# EAGLE schematic Powerboard (EAGLE 9.6.2)

## Sheet 1 of 2: POWER
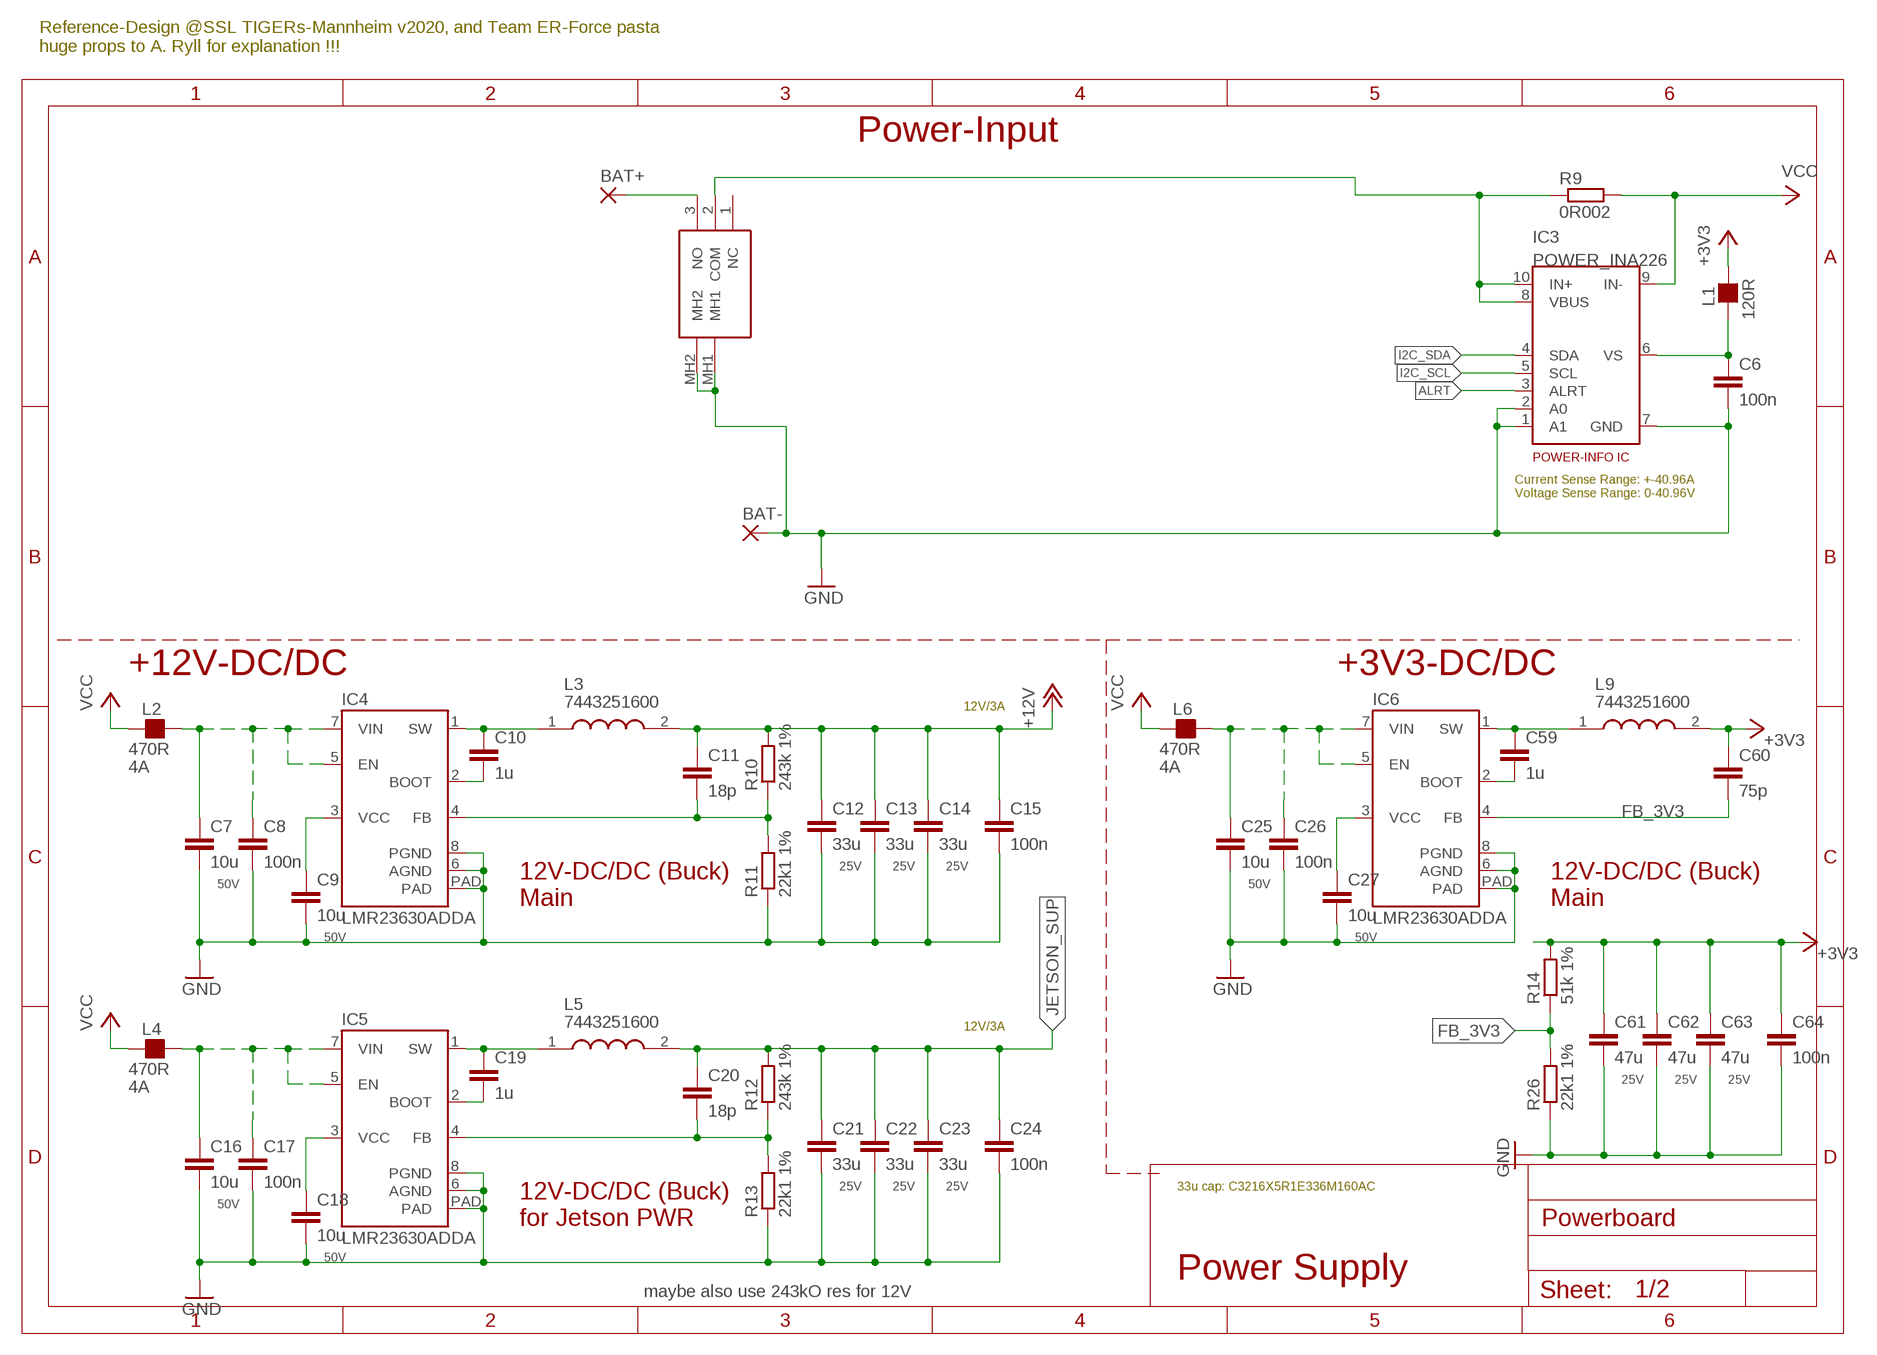
[diagram p0: schematic, sheet 1, part 1 of 2]
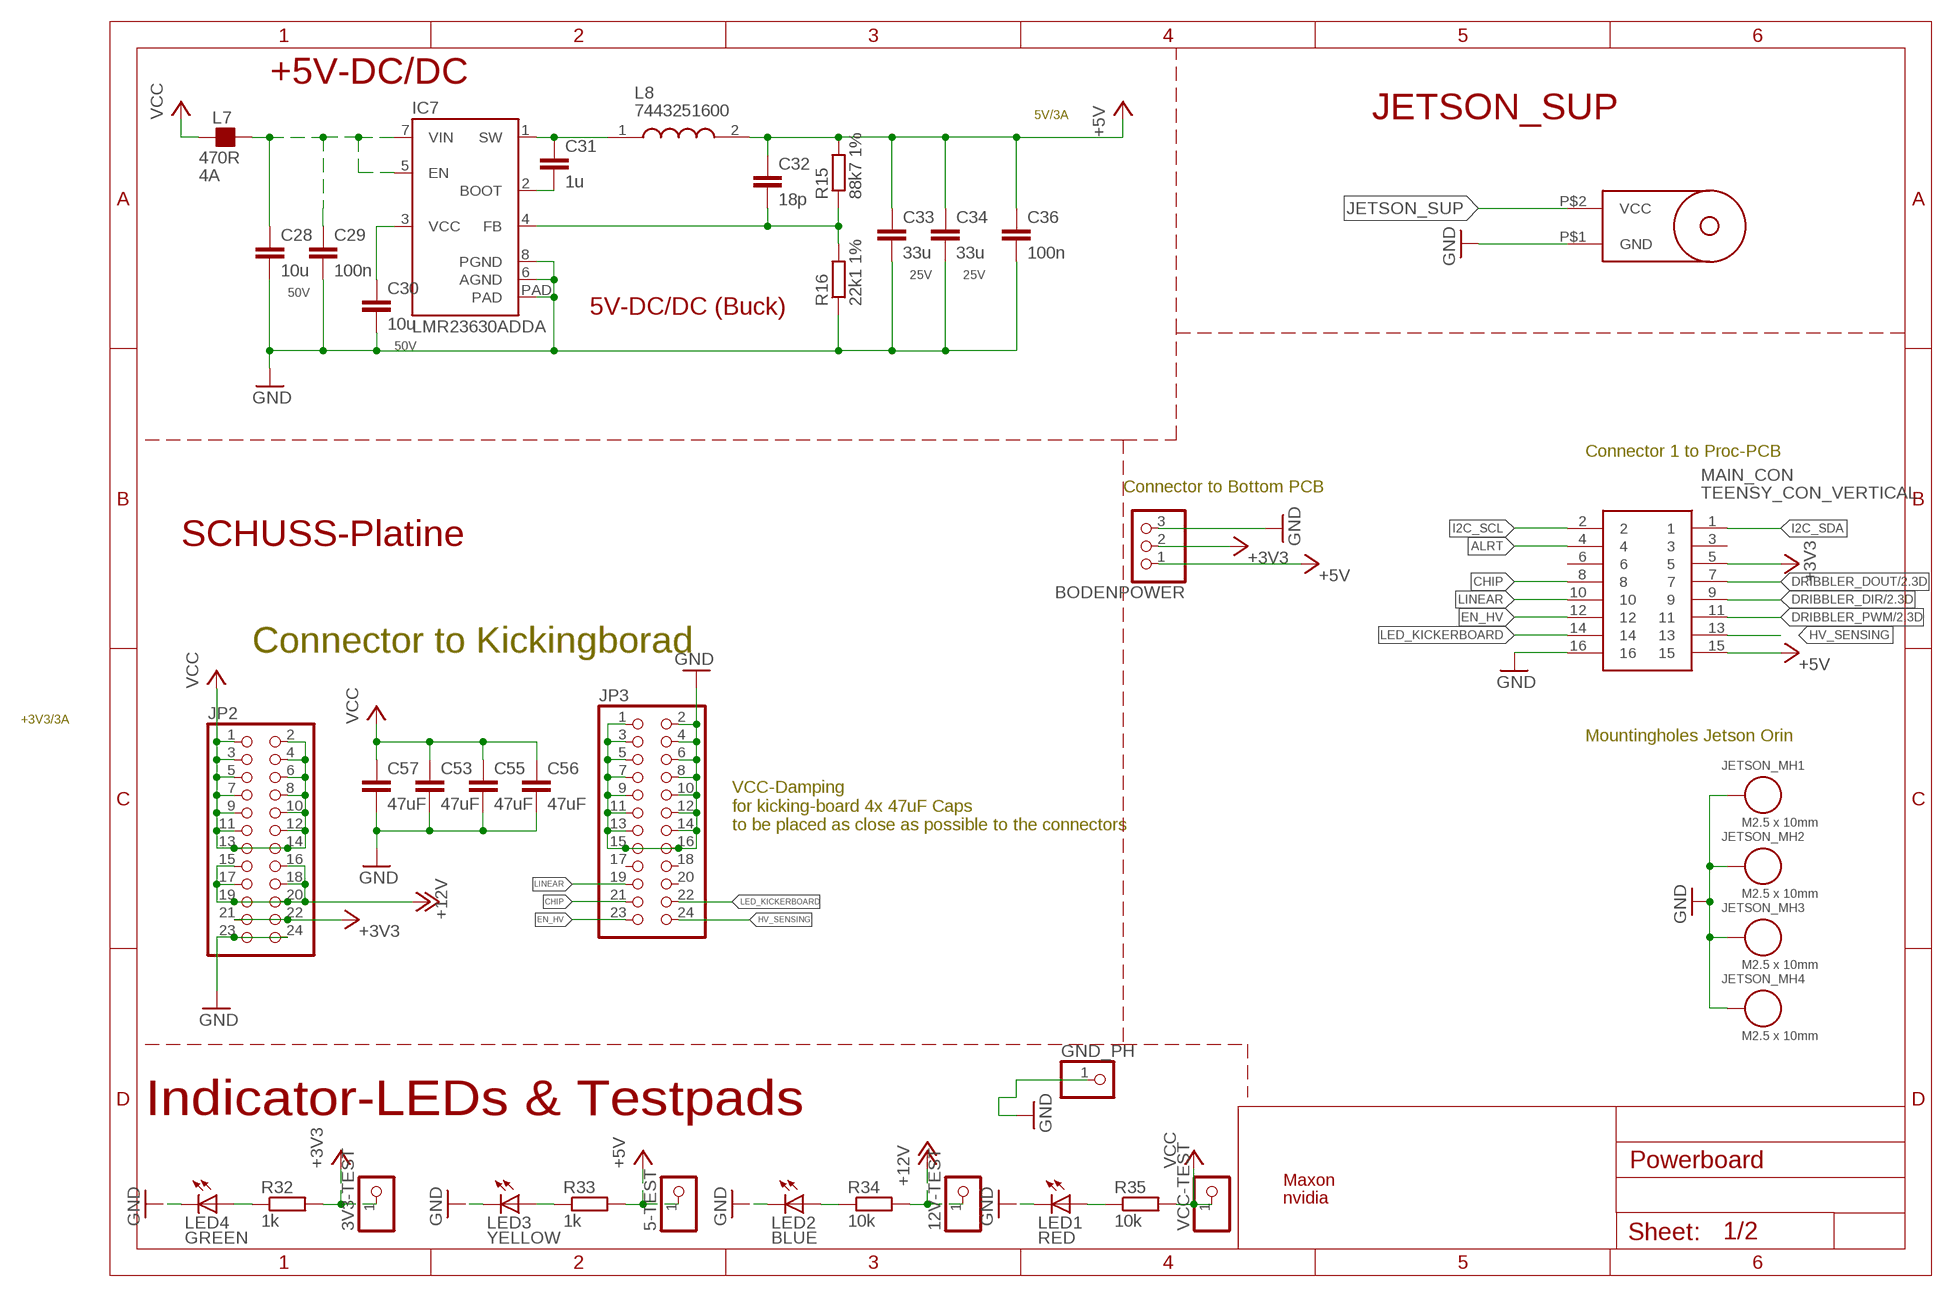
[diagram p1: schematic, sheet 1, part 2 of 2]

### Parts
3V3-TEST  PINHD-1X1  [1X01]
5-TEST  PINHD-1X1  [1X01]
12V-TEST  PINHD-1X1  [1X01]
BAT+  WIREPAD5,08/3  [5,08/3]
BAT-  WIREPAD5,08/3  [5,08/3]
BODENPOWER  PINHD-1X3  [1X03]
C6  100n  C-EUC0603  [C0603]
C7  10u  C-EUC1206  [C1206]
C8  100n  C-EUC0603  [C0603]
C9  10u  C-EUC1206  [C1206]
C10  1u  C-EUC0603  [C0603]
C11  18p  C-EUC0603  [C0603]
C12  33u  C-EUC1206  [C1206]
C13  33u  C-EUC1206  [C1206]
C14  33u  C-EUC1206  [C1206]
C15  100n  C-EUC0603  [C0603]
C16  10u  C-EUC1206  [C1206]
C17  100n  C-EUC0603  [C0603]
C18  10u  C-EUC1206  [C1206]
C19  1u  C-EUC0603  [C0603]
C20  18p  C-EUC0603  [C0603]
C21  33u  C-EUC1206  [C1206]
C22  33u  C-EUC1206  [C1206]
C23  33u  C-EUC1206  [C1206]
C24  100n  C-EUC0603  [C0603]
C25  10u  C-EUC1206  [C1206]
C26  100n  C-EUC0603  [C0603]
C27  10u  C-EUC1206  [C1206]
C28  10u  C-EUC1206  [C1206]
C29  100n  C-EUC0603  [C0603]
C30  10u  C-EUC1206  [C1206]
C31  1u  C-EUC0603  [C0603]
C32  18p  C-EUC0603  [C0603]
C33  33u  C-EUC1206  [C1206]
C34  33u  C-EUC1206  [C1206]
C36  100n  C-EUC0603  [C0603]
C53  47uF  C-EUC1210  [C1210]
C55  47uF  C-EUC1210  [C1210]
C56  47uF  C-EUC1210  [C1210]
C57  47uF  C-EUC1210  [C1210]
C59  1u  C-EUC0603  [C0603]
C60  75p  C-EUC0603  [C0603]
C61  47u  C-EUC1206  [C1206]
C62  47u  C-EUC1206  [C1206]
C63  47u  C-EUC1206  [C1206]
C64  100n  C-EUC0603  [C0603]
GND_PH  PINHD-1X1  [1X01]
IC3  POWER_INA226  [TIGERS_DGS_S-PDSO-G10]
IC4  LMR23630ADDA  POWER_LMR23630_DDA  [TIGERS_DDA_R-PDSO-G8]
IC5  LMR23630ADDA  POWER_LMR23630_DDA  [TIGERS_DDA_R-PDSO-G8]
IC6  LMR23630ADDA  POWER_LMR23630_DDA  [TIGERS_DDA_R-PDSO-G8]
IC7  LMR23630ADDA  POWER_LMR23630_DDA  [TIGERS_DDA_R-PDSO-G8]
JETSON_MH1  M2.5 x 10mm  M2.5_STEELSPACER_9774100151R  [WA-SMSI_9774100151]
JETSON_MH2  M2.5 x 10mm  M2.5_STEELSPACER_9774100151R  [WA-SMSI_9774100151]
JETSON_MH3  M2.5 x 10mm  M2.5_STEELSPACER_9774100151R  [WA-SMSI_9774100151]
JETSON_MH4  M2.5 x 10mm  M2.5_STEELSPACER_9774100151R  [WA-SMSI_9774100151]
JP2  PINHD-2X12  [2X12]
JP3  PINHD-2X12  [2X12]
L1  120R  FB_0603  [L0603]
L2  470R  FB_1206  [L1206]
L3  7443251600  POWER_WE_HCI  [7443251600_WE-HCI_105023]
L4  470R  FB_1206  [L1206]
L5  7443251600  POWER_WE_HCI  [7443251600_WE-HCI_105023]
L6  470R  FB_1206  [L1206]
L7  470R  FB_1206  [L1206]
L8  7443251600  POWER_WE_HCI  [7443251600_WE-HCI_105023]
L9  7443251600  POWER_WE_HCI  [7443251600_WE-HCI_105023]
LED1  RED  POWER_LED-RED-CHIPLED_0805  [POWER_DISTRIBUTION_CHIPLED_0805]
LED2  BLUE  POWER_LED-RED-CHIPLED_0805  [POWER_DISTRIBUTION_CHIPLED_0805]
LED3  YELLOW  POWER_LED-RED-CHIPLED_0805  [POWER_DISTRIBUTION_CHIPLED_0805]
LED4  GREEN  POWER_LED-RED-CHIPLED_0805  [POWER_DISTRIBUTION_CHIPLED_0805]
MAIN_CON  TEENSY_CON_VERTICAL  [501645-1620_5016451620]
R9  0R002  R-EU_R2512  [R2512]
R10  243k 1%  R-EU_R0603  [R0603]
R11  22k1 1%  R-EU_R0603  [R0603]
R12  243k 1%  R-EU_R0603  [R0603]
R13  22k1 1%  R-EU_R0603  [R0603]
R14  51k 1%  R-EU_R0603  [R0603]
R15  88k7 1%  R-EU_R0603  [R0603]
R16  22k1 1%  R-EU_R0603  [R0603]
R26  22k1 1%  R-EU_R0603  [R0603]
R32  1k  R-EU_R0603  [R0603]
R33  1k  R-EU_R0603  [R0603]
R34  10k  R-EU_R0603  [R0603]
R35  10k  R-EU_R0603  [R0603]
S1  500SSP1S1M6QEB  [500SSP1S1M6QEB]
U$5  JETSON_ORIN-PWRJACK  [PWRJACK]
U$10  MAXON_LOGO  [MAXON_LOGO]
U$11  NVIDIA-LOGO  [NVIDIA-LOGO]
VCC-TEST  PINHD-1X1  [1X01]

### Nets
+3V3: 3V3-TEST.1 BODENPOWER.2 C60.1 C61.1 C62.1 C63.1 C64.1 JP2.21 JP2.22 L1.2 L9.2 MAIN_CON.5 R14.2 R32.2
+5V: 5-TEST.1 BODENPOWER.1 C32.1 C33.1 C34.1 C36.1 L8.2 MAIN_CON.15 R15.2 R33.2
+12V: 12V-TEST.1 C11.1 C12.1 C13.1 C14.1 C15.1 JP2.15 JP2.16 JP2.17 JP2.18 JP2.19 JP2.20 L3.2 R10.2 R34.2 ; also sheet 2
ALRT: IC3.3(ALRT) MAIN_CON.4
BAT_SENSE2: IC3.8(VBUS) IC3.10(IN+) R9.1 S1.2(COM)
BOOT_5V: C31.2 IC7.2(BOOT)
BOOT_12V_1: C10.2 IC4.2(BOOT)
BOOT_12V_2: C19.2 IC5.2(BOOT)
BOOT_12V_4: C59.2 IC6.2(BOOT)
CHIP: JP3.21 MAIN_CON.8
DRIBBLER_DIR: MAIN_CON.9 ; also sheet 2
DRIBBLER_DOUT: MAIN_CON.7 ; also sheet 2
DRIBBLER_PWM: MAIN_CON.11 ; also sheet 2
EN_HV: JP3.23 MAIN_CON.12
FB_3V3: C60.2 IC6.4(FB) R14.1 R26.2
FB_5V: C32.2 IC7.4(FB) R15.1 R16.2
FB_12V_1: C11.2 IC4.4(FB) R10.1 R11.2
FB_12V_2: C20.2 IC5.4(FB) R12.1 R13.2
GND: BAT-.P$1(P) BODENPOWER.3 C6.2 C7.2 C8.2 C9.2 C12.2 C13.2 C14.2 C15.2 C16.2 C17.2 C18.2 C21.2 C22.2 C23.2 C24.2 C25.2 C26.2 C27.2 C28.2 C29.2 C30.2 C33.2 C34.2 C36.2 C53.2 C55.2 C56.2 C57.2 C61.2 C62.2 C63.2 C64.2 GND_PH.1 IC3.1(A1) IC3.2(A0) IC3.7(GND) IC4.6(AGND) IC4.8(PGND) IC4.PAD IC5.6(AGND) IC5.8(PGND) IC5.PAD IC6.6(AGND) IC6.8(PGND) IC6.PAD IC7.6(AGND) IC7.8(PGND) IC7.PAD JETSON_MH1.1 JETSON_MH2.1 JETSON_MH3.1 JETSON_MH4.1 JP2.23 JP2.24 JP3.1 JP3.2 JP3.3 JP3.4 JP3.5 JP3.6 JP3.7 JP3.8 JP3.9 JP3.10 JP3.11 JP3.12 JP3.13 JP3.14 JP3.15 JP3.16 LED1.C LED2.C LED3.C LED4.C MAIN_CON.16 R11.1 R13.1 R16.1 R26.1 S1.MH1 S1.MH2 U$5.P$1(GND) ; also sheet 2
HV_SENSING: JP3.24 MAIN_CON.13
I2C_SCL: IC3.5(SCL) MAIN_CON.2
I2C_SDA: IC3.4(SDA) MAIN_CON.1
JETSON_SUP: C20.1 C21.1 C22.1 C23.1 C24.1 L5.2 R12.2 U$5.P$2(VCC)
LED_KICKERBOARD: JP3.22 MAIN_CON.14
LINEAR: JP3.19 MAIN_CON.10
N$1: BAT+.P$1(P) S1.3(NO)
N$4: LED1.A R35.1
N$14: LED4.A R32.1
N$15: LED3.A R33.1
N$30: LED2.A R34.1
SW_3V3: C59.1 IC6.1(SW) L9.1
SW_5V: C31.1 IC7.1(SW) L8.1
SW_12V_1: C10.1 IC4.1(SW) L3.1
SW_12V_2: C19.1 IC5.1(SW) L5.1
V_INA: C6.1 IC3.6(VS) L1.1
VCC: C53.1 C55.1 C56.1 C57.1 IC3.9(IN-) JP2.1 JP2.2 JP2.3 JP2.4 JP2.5 JP2.6 JP2.7 JP2.8 JP2.9 JP2.10 JP2.11 JP2.12 JP2.13 JP2.14 L2.1 L4.1 L6.1 L7.1 R9.2 R35.2 VCC-TEST.1 ; also sheet 2
VCC_3V3: C27.1 IC6.3(VCC)
VCC_5V: C30.1 IC7.3(VCC)
VCC_12V_1: C9.1 IC4.3(VCC)
VCC_12V_2: C18.1 IC5.3(VCC)
VIN_3V3: C25.1 C26.1 IC6.5(EN) IC6.7(VIN) L6.2
VIN_5V: C28.1 C29.1 IC7.5(EN) IC7.7(VIN) L7.2
VIN_12V_1: C7.1 C8.1 IC4.5(EN) IC4.7(VIN) L2.2
VIN_12V_2: C16.1 C17.1 IC5.5(EN) IC5.7(VIN) L4.2
Unconnected: JP3.17 JP3.18 JP3.20 MAIN_CON.3 MAIN_CON.6 S1.1(NC)

### Notes on the sheet
- Reference-Design @SSL TIGERs-Mannheim v2020, and Team ER-Force pasta
  huge props to A. Ryll for explanation !!!
- Power-Input | +5V-DC/DC
- 5V/3A | JETSON_SUP
- 5V-DC/DC (Buck)
- POWER-INFO IC
- Current Sense Range: +-40.96A
  Voltage Sense Range: 0-40.96V
- Connector 1 to Proc-PCB
- Connector to Bottom PCB
- SCHUSS-Platine
- +12V-DC/DC | +3V3-DC/DC
- 12V/3A | Connector to Kickingborad
- +3V3/3A
- Mountingholes Jetson Orin
- VCC-Damping
  for kicking-board 4x 47uF Caps 
  to be placed as close as possible to the connectors
- 12V-DC/DC (Buck) 
  Main
- 12V-DC/DC (Buck) 
  Main
- 12V/3A
- Indicator-LEDs & Testpads
- 33u cap: C3216X5R1E336M160AC
- 12V-DC/DC (Buck) 
  for Jetson PWR
- Power Supply
- maybe also use 243kO res for 12V

## Sheet 2 of 2: Motor
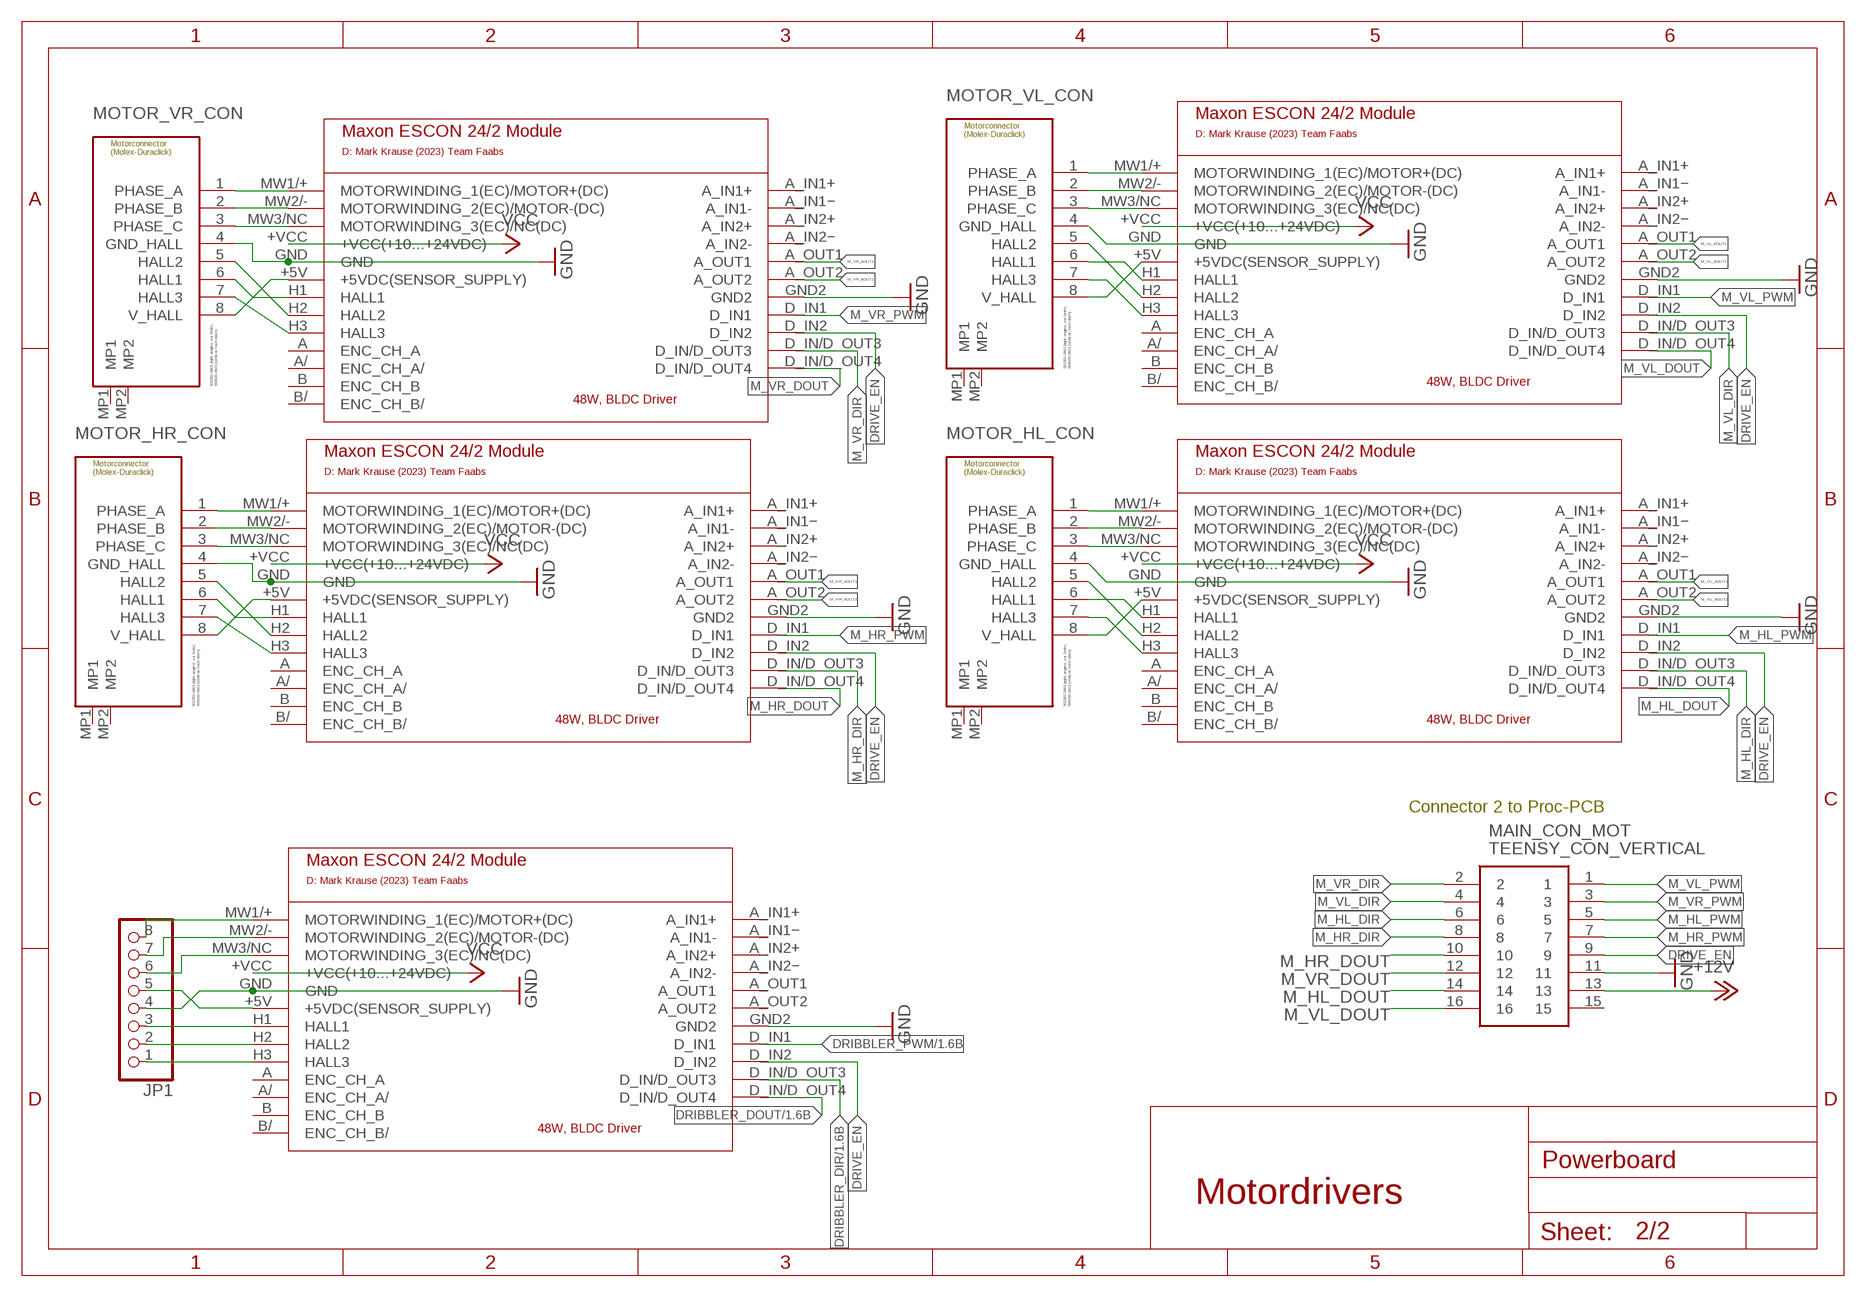
[diagram p2: schematic, sheet 2, part 1 of 2]
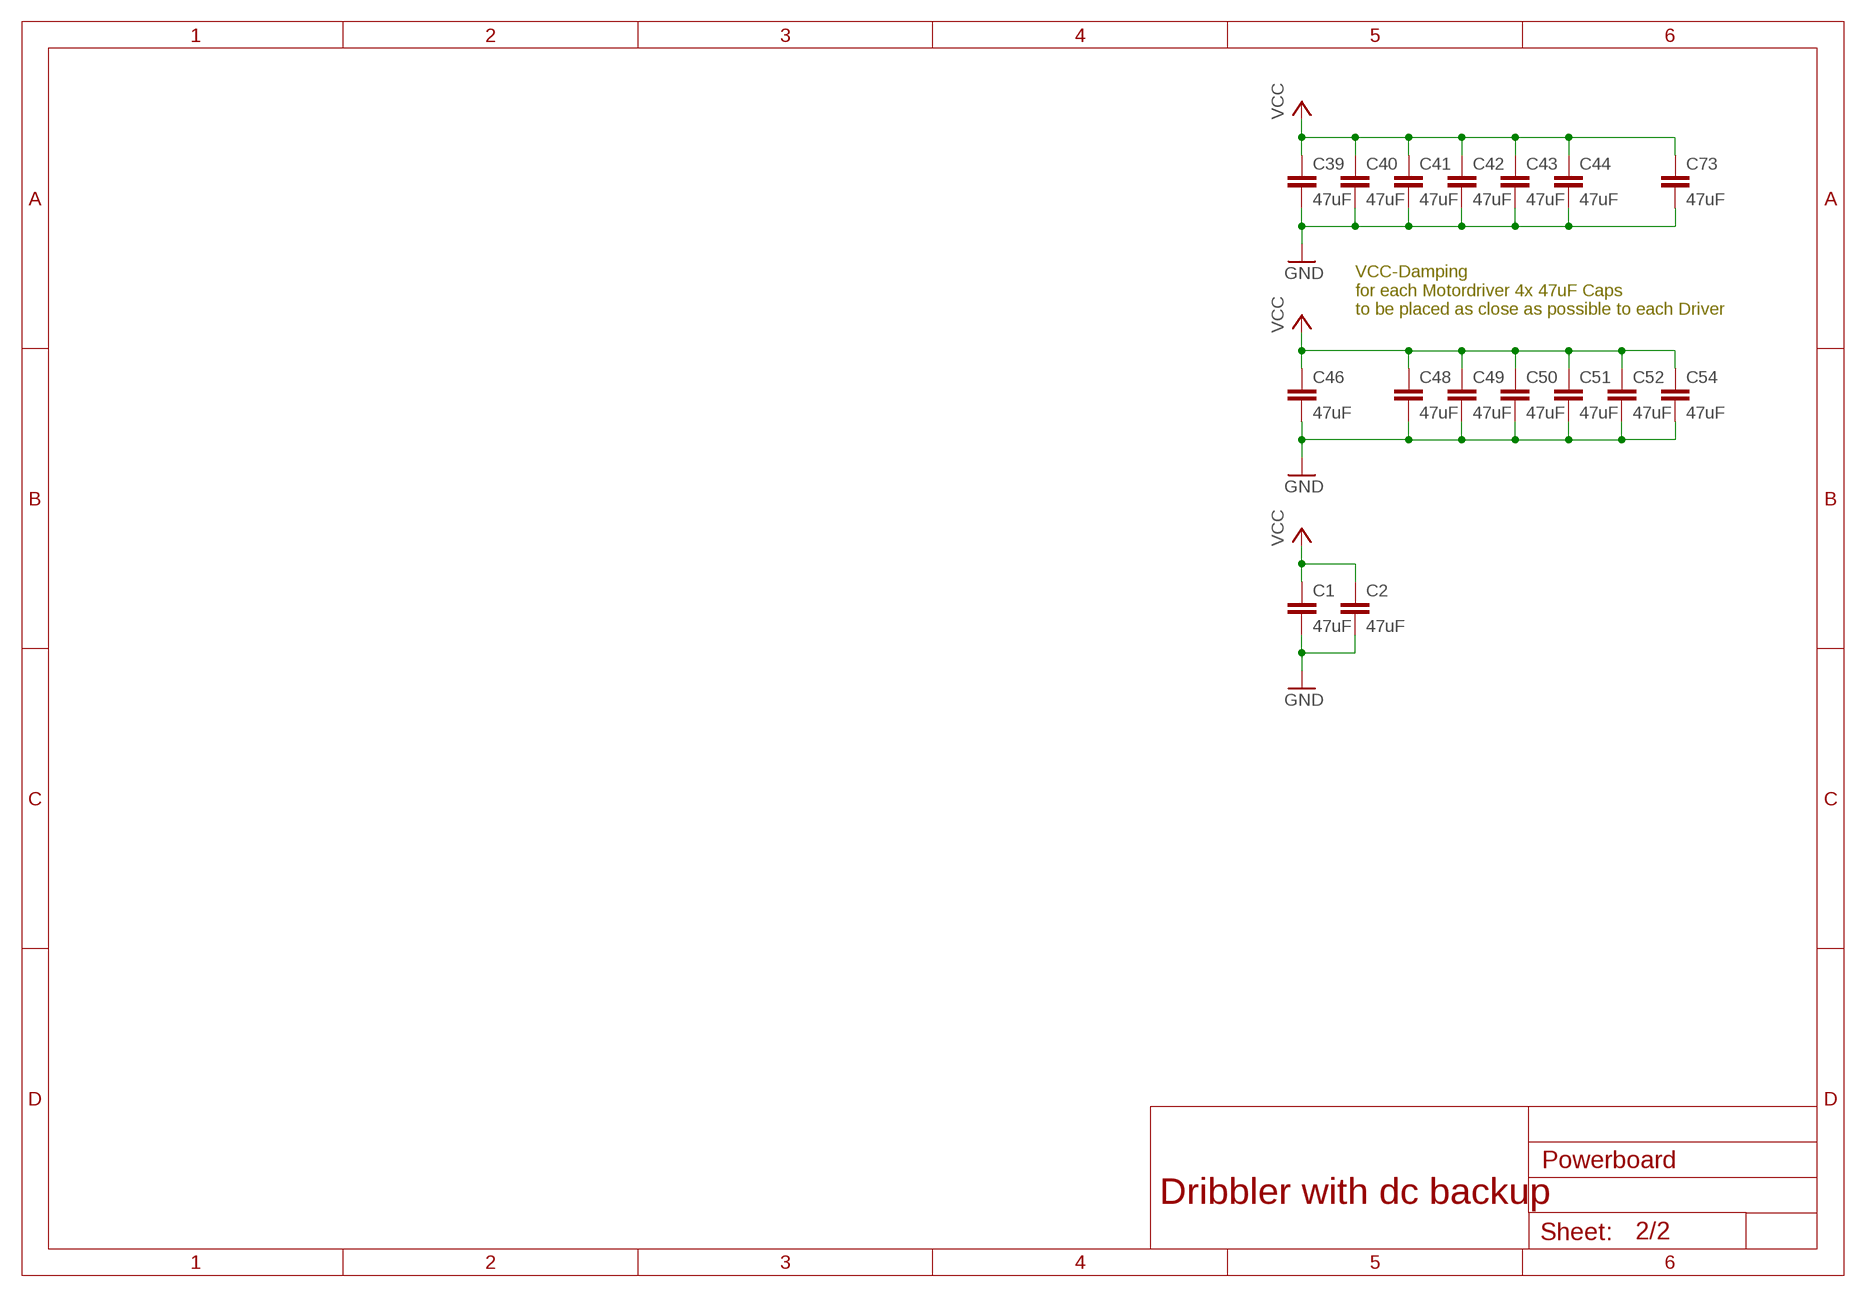
[diagram p3: schematic, sheet 2, part 2 of 2]

### Parts
C1  47uF  C-EUC1210  [C1210]
C2  47uF  C-EUC1210  [C1210]
C39  47uF  C-EUC1210  [C1210]
C40  47uF  C-EUC1210  [C1210]
C41  47uF  C-EUC1210  [C1210]
C42  47uF  C-EUC1210  [C1210]
C43  47uF  C-EUC1210  [C1210]
C44  47uF  C-EUC1210  [C1210]
C46  47uF  C-EUC1210  [C1210]
C48  47uF  C-EUC1210  [C1210]
C49  47uF  C-EUC1210  [C1210]
C50  47uF  C-EUC1210  [C1210]
C51  47uF  C-EUC1210  [C1210]
C52  47uF  C-EUC1210  [C1210]
C54  47uF  C-EUC1210  [C1210]
C73  47uF  C-EUC1210  [C1210]
JP1  PINHD-1X8/90  [1X08/90]
MAIN_CON_MOT  TEENSY_CON_VERTICAL  [501645-1620_5016451620]
MOTOR_HL_CON  MOTOR_CONMOTOR_CON_VERTICAL  [MOTOR_CON_VERTICAL]
MOTOR_HR_CON  MOTOR_CONMOTOR_CON_VERTICAL  [MOTOR_CON_VERTICAL]
MOTOR_VL_CON  MOTOR_CONMOTOR_CON_VERTICAL  [MOTOR_CON_VERTICAL]
MOTOR_VR_CON  MOTOR_CONMOTOR_CON_VERTICAL  [MOTOR_CON_VERTICAL]
U$1  MAXON_ESCON24/2  [MAXON_ESCON24/2_MODULE]
U$2  MAXON_ESCON24/2  [MAXON_ESCON24/2_MODULE]
U$3  MAXON_ESCON24/2  [MAXON_ESCON24/2_MODULE]
U$4  MAXON_ESCON24/2  [MAXON_ESCON24/2_MODULE]
U$6  MAXON_ESCON24/2  [MAXON_ESCON24/2_MODULE]

### Nets
+12V: MAIN_CON_MOT.13 ; also sheet 1
DRIBBLER_DIR: U$6.D_IN/D_OUT3 ; also sheet 1
DRIBBLER_DOUT: U$6.D_IN/D_OUT4 ; also sheet 1
DRIBBLER_PWM: U$6.D_IN1 ; also sheet 1
DRIVE_EN: MAIN_CON_MOT.9 U$1.D_IN2 U$2.D_IN2 U$3.D_IN2 U$4.D_IN2 U$6.D_IN2
GND: C1.2 C2.2 C39.2 C40.2 C41.2 C42.2 C43.2 C44.2 C46.2 C48.2 C49.2 C50.2 C51.2 C52.2 C54.2 C73.2 MAIN_CON_MOT.11 MOTOR_HL_CON.4(GND_HALL) MOTOR_HR_CON.4(GND_HALL) MOTOR_VL_CON.4(GND_HALL) MOTOR_VR_CON.4(GND_HALL) U$1.GND U$1.GND2 U$2.GND U$2.GND2 U$3.GND U$3.GND2 U$4.GND U$4.GND2 U$6.GND2 ; also sheet 1
M_HL_AOUT1: U$4.A_OUT1
M_HL_AOUT2: U$4.A_OUT2
M_HL_DIR: MAIN_CON_MOT.6 U$4.D_IN/D_OUT3
M_HL_DOUT: MAIN_CON_MOT.14 U$4.D_IN/D_OUT4
M_HL_PWM: MAIN_CON_MOT.5 U$4.D_IN1
M_HR_AOUT1: U$1.A_OUT1
M_HR_AOUT2: U$1.A_OUT2
M_HR_DIR: MAIN_CON_MOT.8 U$1.D_IN/D_OUT3
M_HR_DOUT: MAIN_CON_MOT.10 U$1.D_IN/D_OUT4
M_HR_PWM: MAIN_CON_MOT.7 U$1.D_IN1
M_VL_AOUT1: U$3.A_OUT1
M_VL_AOUT2: U$3.A_OUT2
M_VL_DIR: MAIN_CON_MOT.4 U$3.D_IN/D_OUT3
M_VL_DOUT: MAIN_CON_MOT.16 U$3.D_IN/D_OUT4
M_VL_PWM: MAIN_CON_MOT.1 U$3.D_IN1
M_VR_AOUT1: U$2.A_OUT1
M_VR_AOUT2: U$2.A_OUT2
M_VR_DIR: MAIN_CON_MOT.2 U$2.D_IN/D_OUT3
M_VR_DOUT: MAIN_CON_MOT.12 U$2.D_IN/D_OUT4
M_VR_PWM: MAIN_CON_MOT.3 U$2.D_IN1
MOTOR_D_A: JP1.8 U$6.MW1/+(MOTORWINDING_1(EC)/MOTOR+(DC))
MOTOR_D_B: JP1.7 U$6.MW2/-(MOTORWINDING_2(EC)/MOTOR-(DC))
MOTOR_D_C: JP1.6 U$6.MW3/NC(MOTORWINDING_3(EC)/NC(DC))
MOTOR_D_H1: JP1.3 U$6.H1(HALL1)
MOTOR_D_H2: JP1.2 U$6.H2(HALL2)
MOTOR_D_H3: JP1.1 U$6.H3(HALL3)
MOTOR_D_VHALL: JP1.5 U$6.+5V(+5VDC(SENSOR_SUPPLY))
MOTOR_HL_A: MOTOR_HL_CON.1(PHASE_A) U$4.MW1/+(MOTORWINDING_1(EC)/MOTOR+(DC))
MOTOR_HL_B: MOTOR_HL_CON.2(PHASE_B) U$4.MW2/-(MOTORWINDING_2(EC)/MOTOR-(DC))
MOTOR_HL_C: MOTOR_HL_CON.3(PHASE_C) U$4.MW3/NC(MOTORWINDING_3(EC)/NC(DC))
MOTOR_HL_H1: MOTOR_HL_CON.6(HALL1) U$4.H1(HALL1)
MOTOR_HL_H2: MOTOR_HL_CON.5(HALL2) U$4.H2(HALL2)
MOTOR_HL_H3: MOTOR_HL_CON.7(HALL3) U$4.H3(HALL3)
MOTOR_HL_VHALL: MOTOR_HL_CON.8(V_HALL) U$4.+5V(+5VDC(SENSOR_SUPPLY))
MOTOR_HR_A: MOTOR_HR_CON.1(PHASE_A) U$1.MW1/+(MOTORWINDING_1(EC)/MOTOR+(DC))
MOTOR_HR_B: MOTOR_HR_CON.2(PHASE_B) U$1.MW2/-(MOTORWINDING_2(EC)/MOTOR-(DC))
MOTOR_HR_C: MOTOR_HR_CON.3(PHASE_C) U$1.MW3/NC(MOTORWINDING_3(EC)/NC(DC))
MOTOR_HR_H1: MOTOR_HR_CON.6(HALL1) U$1.H1(HALL1)
MOTOR_HR_H2: MOTOR_HR_CON.5(HALL2) U$1.H2(HALL2)
MOTOR_HR_H3: MOTOR_HR_CON.7(HALL3) U$1.H3(HALL3)
MOTOR_HR_VHALL: MOTOR_HR_CON.8(V_HALL) U$1.+5V(+5VDC(SENSOR_SUPPLY))
MOTOR_VL_A: MOTOR_VL_CON.1(PHASE_A) U$3.MW1/+(MOTORWINDING_1(EC)/MOTOR+(DC))
MOTOR_VL_B: MOTOR_VL_CON.2(PHASE_B) U$3.MW2/-(MOTORWINDING_2(EC)/MOTOR-(DC))
MOTOR_VL_C: MOTOR_VL_CON.3(PHASE_C) U$3.MW3/NC(MOTORWINDING_3(EC)/NC(DC))
MOTOR_VL_H1: MOTOR_VL_CON.6(HALL1) U$3.H1(HALL1)
MOTOR_VL_H2: MOTOR_VL_CON.5(HALL2) U$3.H2(HALL2)
MOTOR_VL_H3: MOTOR_VL_CON.7(HALL3) U$3.H3(HALL3)
MOTOR_VL_VHALL: MOTOR_VL_CON.8(V_HALL) U$3.+5V(+5VDC(SENSOR_SUPPLY))
MOTOR_VR_A: MOTOR_VR_CON.1(PHASE_A) U$2.MW1/+(MOTORWINDING_1(EC)/MOTOR+(DC))
MOTOR_VR_B: MOTOR_VR_CON.2(PHASE_B) U$2.MW2/-(MOTORWINDING_2(EC)/MOTOR-(DC))
MOTOR_VR_C: MOTOR_VR_CON.3(PHASE_C) U$2.MW3/NC(MOTORWINDING_3(EC)/NC(DC))
MOTOR_VR_H1: MOTOR_VR_CON.6(HALL1) U$2.H1(HALL1)
MOTOR_VR_H2: MOTOR_VR_CON.5(HALL2) U$2.H2(HALL2)
MOTOR_VR_H3: MOTOR_VR_CON.7(HALL3) U$2.H3(HALL3)
MOTOR_VR_VHALL: MOTOR_VR_CON.8(V_HALL) U$2.+5V(+5VDC(SENSOR_SUPPLY))
N$7: JP1.4 U$6.GND ; supply symbol labelled GND
VCC: C1.1 C2.1 C39.1 C40.1 C41.1 C42.1 C43.1 C44.1 C46.1 C48.1 C49.1 C50.1 C51.1 C52.1 C54.1 C73.1 U$1.+VCC(+VCC(+10...+24VDC)) U$2.+VCC(+VCC(+10...+24VDC)) U$3.+VCC(+VCC(+10...+24VDC)) U$4.+VCC(+VCC(+10...+24VDC)) U$6.+VCC(+VCC(+10...+24VDC)) ; also sheet 1
Unconnected: MAIN_CON_MOT.15 MOTOR_HL_CON.MP1 MOTOR_HL_CON.MP2 MOTOR_HR_CON.MP1 MOTOR_HR_CON.MP2 MOTOR_VL_CON.MP1 MOTOR_VL_CON.MP2 MOTOR_VR_CON.MP1 MOTOR_VR_CON.MP2 U$1.A(ENC_CH_A) U$1.A/(ENC_CH_A/) U$1.A_IN1+ U$1.A_IN1−(A_IN1-) U$1.A_IN2+ U$1.A_IN2−(A_IN2-) U$1.B(ENC_CH_B) U$1.B/(ENC_CH_B/) U$2.A(ENC_CH_A) U$2.A/(ENC_CH_A/) U$2.A_IN1+ U$2.A_IN1−(A_IN1-) U$2.A_IN2+ U$2.A_IN2−(A_IN2-) U$2.B(ENC_CH_B) U$2.B/(ENC_CH_B/) U$3.A(ENC_CH_A) U$3.A/(ENC_CH_A/) U$3.A_IN1+ U$3.A_IN1−(A_IN1-) U$3.A_IN2+ U$3.A_IN2−(A_IN2-) U$3.B(ENC_CH_B) U$3.B/(ENC_CH_B/) U$4.A(ENC_CH_A) U$4.A/(ENC_CH_A/) U$4.A_IN1+ U$4.A_IN1−(A_IN1-) U$4.A_IN2+ U$4.A_IN2−(A_IN2-) U$4.B(ENC_CH_B) U$4.B/(ENC_CH_B/) U$6.A(ENC_CH_A) U$6.A/(ENC_CH_A/) U$6.A_IN1+ U$6.A_IN1−(A_IN1-) U$6.A_IN2+ U$6.A_IN2−(A_IN2-) U$6.A_OUT1 U$6.A_OUT2 U$6.B(ENC_CH_B) U$6.B/(ENC_CH_B/)

### Notes on the sheet
- VCC-Damping
  for each Motordriver 4x 47uF Caps 
  to be placed as close as possible to each Driver
- Connector 2 to Proc-PCB
- Motordrivers | Dribbler with dc backup

## Library data of the parts
3V3-TEST 5-TEST 12V-TEST GND_PH VCC-TEST = pinhead:PINHD-1X1: PIN HEADER
BAT+ BAT- = TIGERs:WIREPAD: Wire PAD connect wire on PCB
BODENPOWER = pinhead:PINHD-1X3: PIN HEADER
C1 C2 C6 C8 C10 C11 C15 C17 C19 C20 C24 C26 C29 C31 C32 C36 C39-C44 C46 C48-C57 C59 C60 C64 C73 = rcl:C-EU: CAPACITOR, European symbol; SPICEPREFIX: C
C7 C9 C16 C18 C25 C27 C28 C30 = rcl:C-EU: CAPACITOR, European symbol; SPICEPREFIX: C; VOLTAGE: 50V
C12-C14 C21-C23 C33 C34 C61-C63 = rcl:C-EU: CAPACITOR, European symbol; SPICEPREFIX: C; VOLTAGE: 25V
IC3 = Open24:POWER_INA226
IC4-IC7 = Open24:POWER_LMR23630_DDA
JETSON_MH1-JETSON_MH4 = Open24:M2.5_STEELSPACER: WA-SMSI SMT Steel Spacer with internal Thread M2.5 Applications Assembling of PCBs to housing and to other PCBs For distances from 1 to 10 mm Fast and precise process Strong holding forces and torques Highest process reliability Instant removable Polyimide Tape Properties Material Steel Surface Tin Ti M2.5 Solder Paste Thickness 150 µm Tightening Torque (Value) 0.35 N*m General Information Operating Temperature -55 up to +150 °C <https://www.we-online.com/catalog/media/o92910v209%20Family_WA-SMSI_M2-M2.5.jpg> Details see: https://www.we-online.com/catalog/en/SMSI_SMT_STEEL_SPACER_M2_5_THREAD_INTERNAL Updated by Ella Wu 2021-06-03 2021(C) Wurth Elektronik; DATASHEET-URL: https://www.we-online.com/catalog/datasheet/9774100151R.pdf; INNER-DIAMETER: 3.5mm; INNER-THREAD-LENGTH: -; OUTER-DIAMETER: 5.1mm; PART-NUMBER: 9774100151R; PIN-LENGTH: 10mm; THREAD: M2.5
JP1 = pinhead:PINHD-1X8: PIN HEADER
JP2 JP3 = pinhead:PINHD-2X12: PIN HEADER
L1 = rc-master-smd:FB_: FERRITE BEAD
L2 L4 L6 L7 = rc-master-smd:FB_: FERRITE BEAD; IMAX: 4A
L3 L5 L8 L9 = Open24:POWER_WE_HCI: SMD-Flat Wire High Current Inductor WE-HCI Source: Datasheet; DESCRIPTION: SMD-Flat Wire High Current Inductor WE-HCI; HEIGHT: mm; MANUFACTURER_NAME: Wurth Elektronik; MANUFACTURER_PART_NUMBER: 7443251600; MOUSER_PART_NUMBER: 710-7443251600; MOUSER_PRICE-STOCK: https://www.mouser.co.uk/ProductDetail/Wurth-Elektronik/7443251600?qs=VxkwJfKV0FSkbbPOgC7FsA%3D%3D
LED1-LED4 = Open24:POWER_LED: LED; MF: Würth Elektronik; MPN: 150080RS75000
MAIN_CON MAIN_CON_MOT = Open24:TEENSY_CON_VERTICAL: MOLEX - 501645-1620 - CONNECTOR, HEADER, 16POS, 2ROW, 2MM Source: Datasheet <https://www.molex.com/pdm_docs/sd/5016451620_sd.pdf>; DESCRIPTION: MOLEX - 501645-1620 - CONNECTOR, HEADER, 16POS, 2ROW, 2MM; HEIGHT: 12mm; MANUFACTURER_NAME: Molex; MANUFACTURER_PART_NUMBER: 501645-1620; MOUSER_PART_NUMBER: 538-501645-1620; MOUSER_PRICE-STOCK: https://www.mouser.co.uk/ProductDetail/Molex/501645-1620?qs=AcmJtBVhzkSktNjjA6%2Faug%3D%3D
MOTOR_HL_CON MOTOR_HR_CON MOTOR_VL_CON MOTOR_VR_CON = Open24:MOTOR_CON: Molex Duraclick 8-Pin SMD Connector PartNB: 502352-0801 or 560020-0821
R9-R16 R26 R32-R35 = rcl:R-EU_: RESISTOR, European symbol; SPICEPREFIX: R
S1 = schalter:500SSP1S1M6QEB: SLIDE, 5A 120VAC/28VDC, SPDT On-On, Through Hole, Right Angle PC Pin Source: Datasheet <https://configured-product-images.s3.amazonaws.com/2D/specs/500SSP1S1M6QEB.pdf>; DESCRIPTION: SLIDE, 5A 120VAC/28VDC, SPDT On-On, Through Hole, Right Angle PC Pin; HEIGHT: 6.1mm; MANUFACTURER_NAME: E-Switch; MANUFACTURER_PART_NUMBER: 500SSP1S1M6QEB; MOUSER_PART_NUMBER: 612-500SSP1S1M6QEB; MOUSER_PRICE-STOCK: https://www.mouser.co.uk/ProductDetail/E-Switch/500SSP1S1M6QEB?qs=0JU57JYmZjtvO38dJ0sbfg%3D%3D
U$1-U$4 U$6 = Motortreiber_MaxonESCON24-2:MAXON_ESCON24/2: designed by Mark Krause from Team Faabs, technulgy Lessing-Gymnasium Neu-ulm, (Dec. 2023)
U$5 = Power:JETSON_ORIN-PWRJACK: 9V-20V Supply Volatage for the Jetson Orin Nano Dev-Kit
U$10 = Sponsorenlogos:MAXON_LOGO
U$11 = Sponsorenlogos:NVIDIA-LOGO

## Net classes
2 power: width 0.406 mm, drill 0.5 mm, clearance 0.15 mm